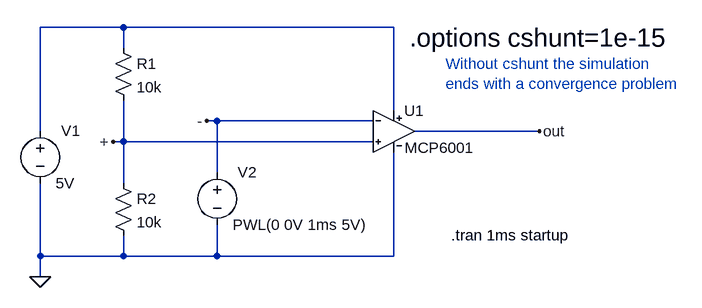
[diagram p0: schematic MCP6001-jig.asc]
MCP6001-jig.asc, the LTspice schematic file:
Version 4
SHEET 1 2096 4288
WIRE -144 -16 -272 -16
WIRE 272 -16 -144 -16
WIRE -144 16 -144 -16
WIRE 272 112 272 -16
WIRE 0 128 -16 128
WIRE 240 128 0 128
WIRE -272 144 -272 -16
WIRE 496 144 304 144
WIRE -144 160 -144 96
WIRE -144 160 -160 160
WIRE 240 160 -144 160
WIRE 0 208 0 128
WIRE -144 224 -144 160
WIRE -272 336 -272 224
WIRE -144 336 -144 304
WIRE -144 336 -272 336
WIRE 0 336 0 288
WIRE 0 336 -144 336
WIRE 272 336 272 176
WIRE 272 336 0 336
WIRE -272 368 -272 336
FLAG -272 368 0
FLAG -160 160 +
FLAG -16 128 -
FLAG 496 144 out
SYMBOL voltage -272 128 R0
WINDOW 0 32 15 Left 2
WINDOW 123 0 0 Left 2
WINDOW 39 0 0 Left 2
SYMATTR InstName V1
SYMATTR Value 5V
SYMBOL voltage 0 192 R0
WINDOW 0 32 15 Left 2
WINDOW 123 0 0 Left 2
WINDOW 39 0 0 Left 2
SYMATTR InstName V2
SYMATTR Value PWL(0 0V 1ms 5V)
SYMBOL res -160 0 R0
SYMATTR InstName R1
SYMATTR Value 10k
SYMBOL res -160 208 R0
SYMATTR InstName R2
SYMATTR Value 10k
SYMBOL _PERSONAL\\opamps\\MCP6001 272 80 R0
SYMATTR InstName U1
TEXT 360 304 Left 2 !.tran 1ms startup
TEXT 296 0 Left 4 !.options cshunt=1e-15
TEXT 352 40 Left 2 ;Without cshunt the simulation \nends with a convergence problem

The netlist it stands for:
* MCP6001-jig.asc
V1 N001 0 5V
V2 - 0 PWL(0 0V 1ms 5V)
R1 N001 + 10k
R2 + 0 10k
XU1 + - N001 0 out MCP6001 MCP6001 MCP6001  ; pins In+ In- V+ V- OUT
.tran 1ms startup
.options cshunt=1e-15
* Without cshunt the simulation
* ends with a convergence problem
.lib ..\sym\_PERSONAL\opamps\MCP6001.sub
.backanno
.end